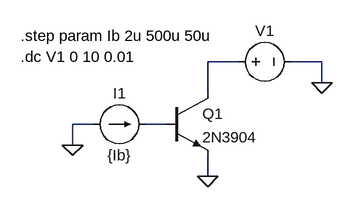
[diagram p0: schematic npn_curve.asc]
npn_curve.asc, the LTspice schematic file:
Version 4
SHEET 1 880 680
WIRE 288 64 240 64
WIRE 416 64 368 64
WIRE 416 96 416 64
WIRE 240 112 240 64
WIRE 64 160 32 160
WIRE 176 160 144 160
WIRE 32 192 32 160
WIRE 240 240 240 208
FLAG 32 192 0
FLAG 416 96 0
FLAG 240 240 0
SYMBOL npn 176 112 R0
SYMATTR InstName Q1
SYMATTR Value 2N3904
SYMBOL current 64 160 R270
WINDOW 0 32 40 VTop 2
WINDOW 3 -32 40 VBottom 2
SYMATTR InstName I1
SYMATTR Value {Ib}
SYMBOL voltage 272 64 R270
WINDOW 0 32 56 VTop 2
WINDOW 3 -32 56 VBottom 2
WINDOW 123 0 0 Left 0
WINDOW 39 0 0 Left 0
SYMATTR InstName V1
SYMATTR Value ""
TEXT -48 24 Left 2 !.step param Ib 2u 500u 50u
TEXT -48 56 Left 2 !.dc V1 0 10 0.01

The netlist it stands for:
* npn_curve.asc
Q1 N001 N002 0 0 2N3904
I1 0 N002 {Ib}
V1 N001 0
.model NPN NPN
.model PNP PNP
.lib standard.bjt
.step param Ib 2u 500u 50u
.dc V1 0 10 0.01
.backanno
.end